# EAGLE design sender (EAGLE 7.7.0)
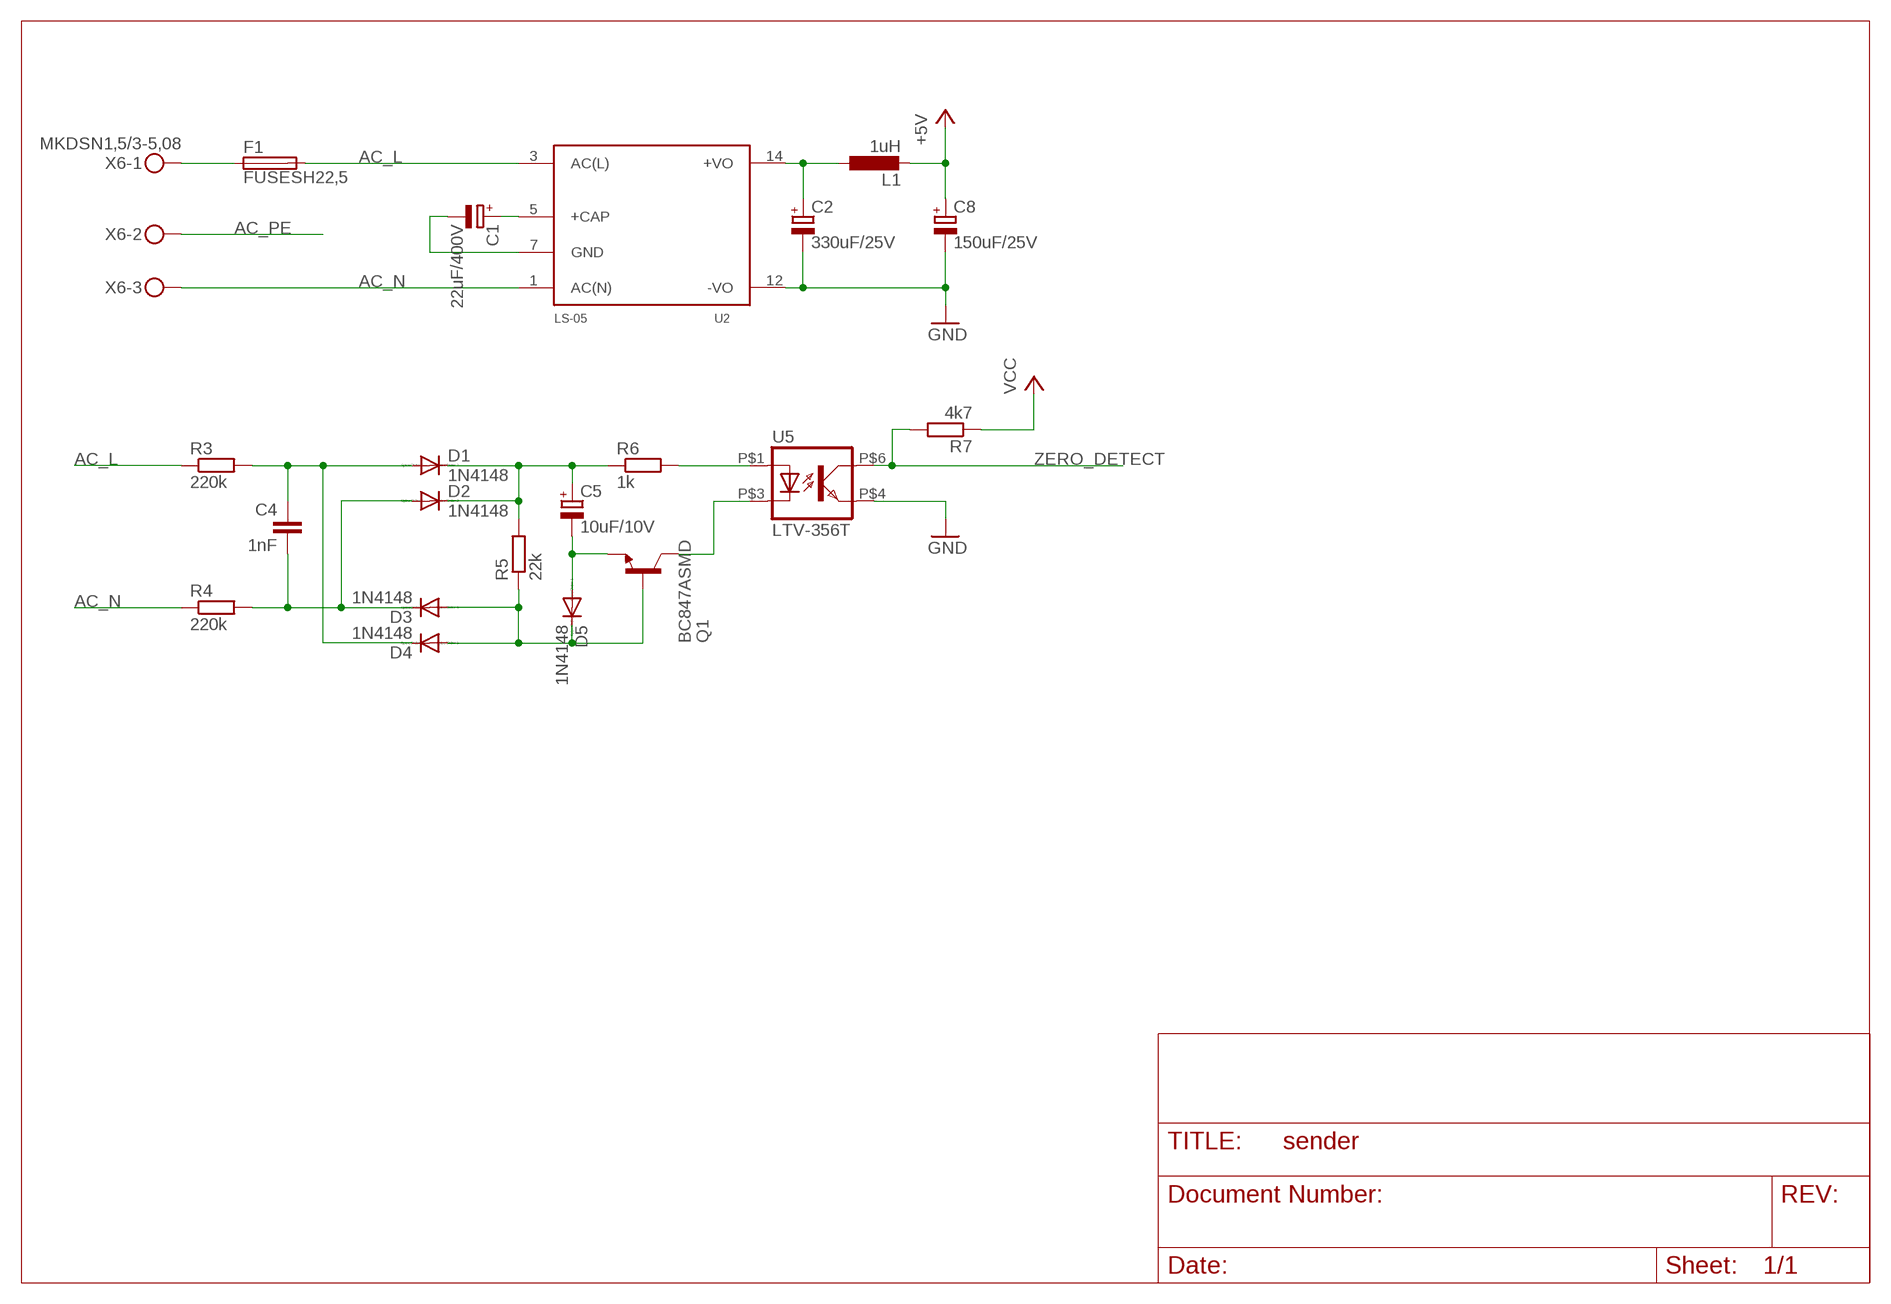
[diagram p0: schematic, sheet 1]

## Parts
C1  22uF/400V  CPOL-EUE7.5-16  [E7,5-16]
C2  330uF/25V  CPOL-EU150CLZ-1010  [150CLZ-1010]
C4  1nF  C-EU050-050X075  [C050-050X075]
C5  10uF/10V  CPOL-EU153CLV-0505  [153CLV-0505]
C8  150uF/25V  CPOL-EU153CLV-0810  [153CLV-0810]
D1  1N4148  DIODE-SOD323-W  [SOD323-W]
D2  1N4148  DIODE-SOD323-W  [SOD323-W]
D3  1N4148  DIODE-SOD323-W  [SOD323-W]
D4  1N4148  DIODE-SOD323-W  [SOD323-W]
D5  1N4148  DIODE-SOD323-W  [SOD323-W]
F1  FUSESH22,5  [SH22,5]
L1  1uH  L-EUL3225P  [L3225P]
Q1  BC847ASMD  [SOT23]
R3  220k  R-EU_R0603  [R0603]
R4  220k  R-EU_R0603  [R0603]
R5  22k  R-EU_R0603  [R0603]
R6  1k  R-EU_R0603  [R0603]
R7  4k7  R-EU_R0603  [R0603]
U2  LS-05  [LS-05]
U5  LTV-356T  [SMD]
X6  MKDSN1,5/3-5,08  [MKDSN1,5/3-5,08]

## Nets
+5V: C8.+ L1.2
AC_L: F1.2 R3.1 U2.3(AC(L))
AC_N: R4.1 U2.1(AC(N)) X6.3
AC_PE: X6.2
GND: C2.- C8.- U2.12(-VO) U5.P$4(EMIT)
N$1: F1.1 X6.1
N$2: C2.+ L1.1 U2.14(+VO)
N$3: C1.+ U2.5(+CAP)
N$4: C4.1 D1.A D4.C R3.2
N$5: C5.+ D1.C D2.C R5.2 R6.1
N$6: C1.- U2.7(GND)
N$7: C4.2 D2.A D3.C R4.2
N$8: D3.A D4.A D5.C Q1.1(B) R5.1
N$9: C5.- D5.A Q1.2(E)
N$10: R6.2 U5.P$1(A)
N$11: Q1.3(C) U5.P$3(C)
VCC: R7.1
ZERO_DETECT: R7.2 U5.P$6(COL)

## Library data of the parts
C1 C2 C5 C8 = rcl:CPOL-EU: POLARIZED CAPACITOR, European symbol
C4 = rcl:C-EU: CAPACITOR, European symbol
D1-D5 = diode:DIODE-: DIODE
F1 = fuse:FUSE: Fuse; OC_FARNELL: unknown; OC_NEWARK: unknown
L1 = rcl:L-EU: INDUCTOR, European symbol
Q1 = transistor-npn:BC847*: NPN Transistor
R3-R7 = rcl:R-EU_: RESISTOR, European symbol
U2 = rs-acdc:LS-05
U5 = optocoupler:LTV-356T
X6 = con-phoenix-508:MKDSN1,5/3-5,08: MKDSN 1,5/ 3-5,08 Printklemme Nennstrom: 13,5 A Nennspannung: 250 V Rastermaß: 5,08 mm Polzahl: 3 Anschlussart: Schraubanschluss Montage: Löten Anschlussrichtung Leiter/Platine: 0 ° Artikelnummer: 1729131 Source: http://eshop.phoenixcontact.com .. 1729131.pdf

## Board
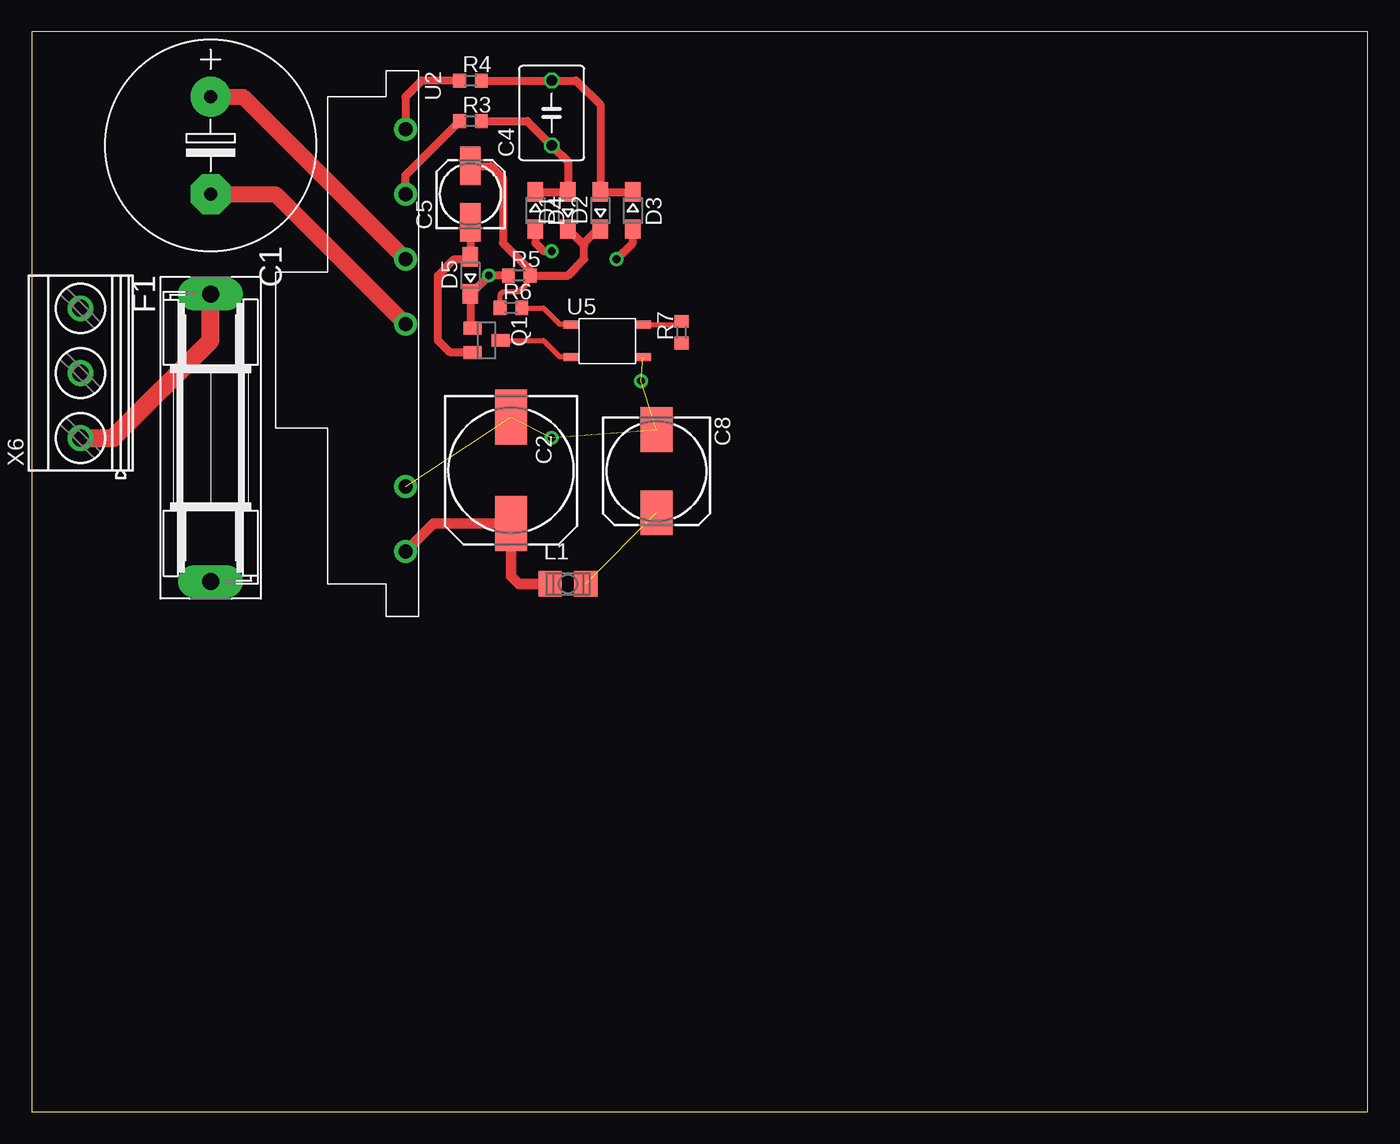
[diagram p1: board, top side]
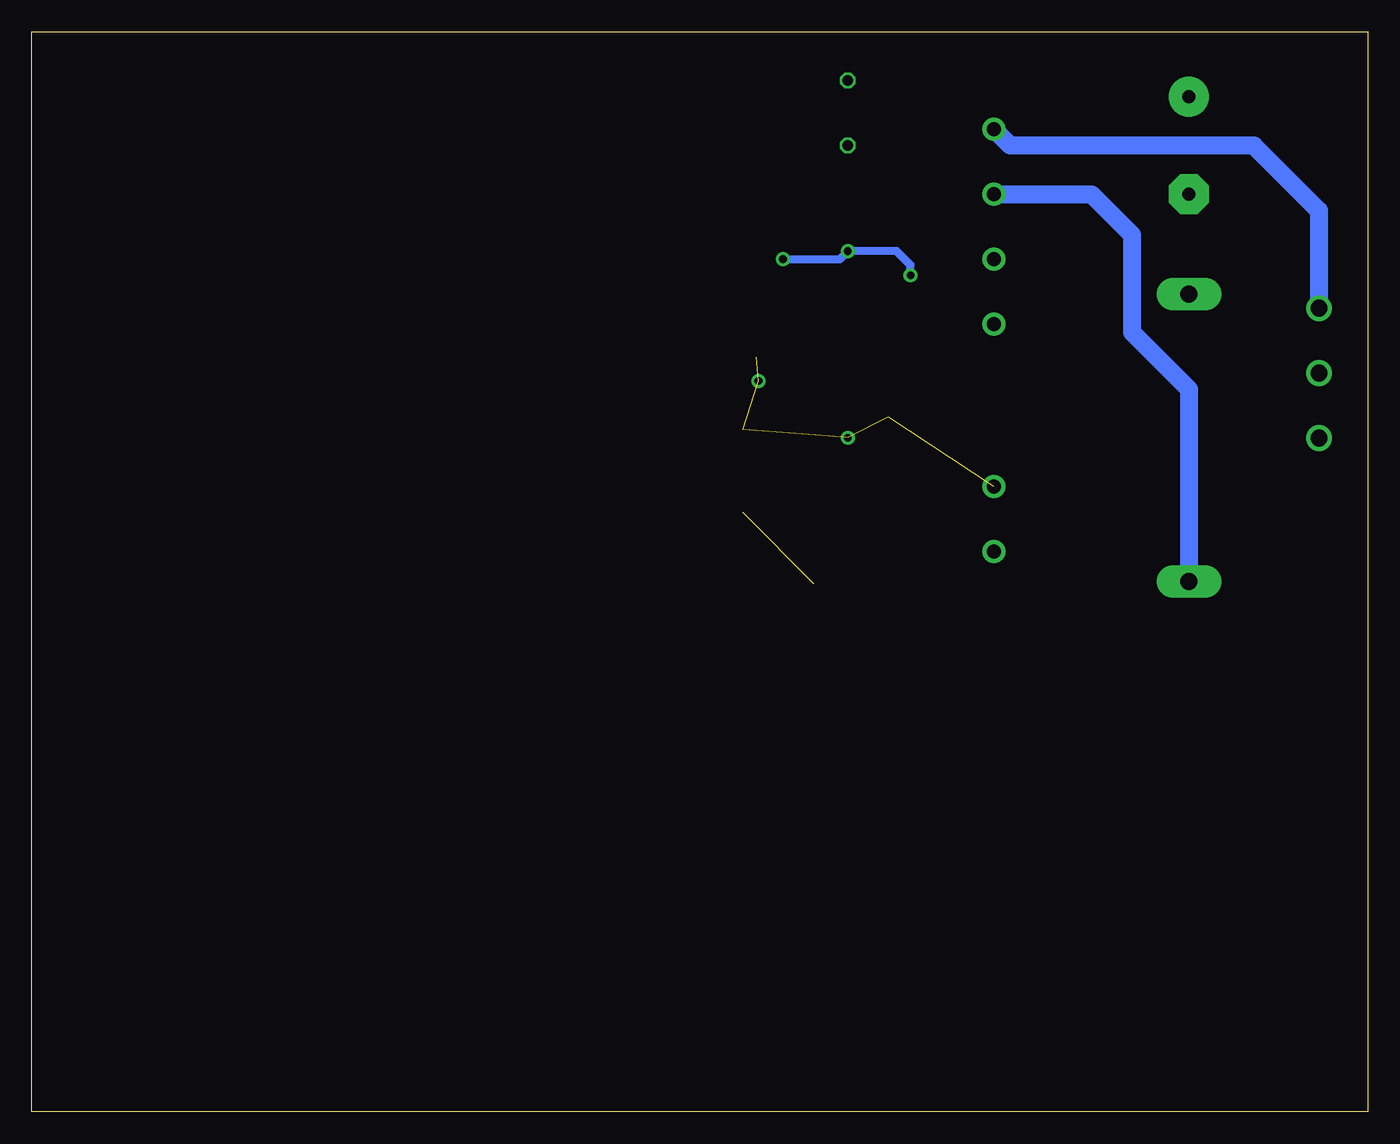
[diagram p2: board, bottom side, seen from below]

Size 104.44 x 84.44 mm. Coordinates in mm from the lower left corner, seen from the top.
Outline: 0,0 104.44,0 104.44,84.44 0,84.44 0,0
Copper layers (1*16): Top 0.035mm / dielectric 1.5mm / Bottom 0.035mm
Design rules "PCB-POOL Standard": minimum track width 0.15mm, minimum drill 0.3mm, track to track 0.15mm, track to pad 0.15mm, pad to pad 0.15mm, via to via 0.15mm, smd to smd 0.15mm, copper to edge 0.3mm, drill to drill 0.2mm, minimum pad ring 0.2mm, minimum via ring 0.15mm, stop-mask expansion 0.075mm, vias tented up to drill 0mil, thermal gap 0.2mm

### Footprints (pad centres in the part's own frame; a part is rotated, then mirrored left to right if it is on the bottom)
E7,5-16 = drill 1.016 pad 3.15: + -3.81,0 | drill 1.016 pad 3.15 octagon: - 3.81,0
150CLZ-1010 = smd 4.3 x 2.5: + 4.15,0; - -4.15,0
C050-050X075 = drill 0.813 octagon: 1 -2.54,0; 2 2.54,0
153CLV-0505 = smd 3 x 1.6: + 2.2,0; - -2.2,0
153CLV-0810 = smd 3.5 x 2.5: + 3.25,0; - -3.25,0
SOD323-W = smd 1.5 x 1.2: A 1.45,0; C -1.45,0
SH22,5 = drill 1.321 pad 2.54 long: 1 -11.252,0; 2 11.252,0
L3225P = smd 1.8 x 2: 1 -1.4,0; 2 1.4,0
SOT23 = smd 1 x 1.4: 1 -0.95,-1.1; 2 0.95,-1.1; 3 0,1.1
R0603 = smd 1 x 1.1: 1 -0.85,0; 2 0.85,0
LS-05 = drill 1.1 pad 1.778: 1 -17.78,0; 3 -12.7,0; 5 -7.62,0; 7 -2.54,0; 12 10.16,0; 14 15.24,0
SMD = smd 1.27 x 0.635: P$1 -2.88,1.24; P$3 -2.88,-1.3; P$4 2.7,-1.3; P$6 2.7,1.24
MKDSN1,5/3-5,08 = drill 1.3 pad 2: 1 -7.641,0.025; 2 -2.561,0.025; 3 2.519,0.025

### Placement (x,y rotation side)
C1  13.97,75.56 270 top
C2  37.47,50.17 270 top
C4  40.64,78.1 90 top
C5  34.29,71.75 90 top
C8  48.84,50.1 270 top
D1  41.91,70.48 90 top
D2  44.45,70.48 90 top
D3  46.99,70.48 270 top
D4  39.37,70.48 270 top
D5  34.29,65.41 90 top
F1  13.97,52.71 270 top
L1  41.91,41.28 0 top
Q1  35.56,60.33 270 top
R3  34.29,77.47 0 top
R4  34.29,80.64 0 top
R5  38.1,65.41 0 top
R6  37.47,62.87 0 top
R7  50.8,60.96 90 top
U2  29.21,59.05 270 top
U5  45.09,60.33 0 top
X6  3.81,60.33 90 top

### Tracks (layer width: path | path; a pad name or v marks a point on that pad's centre or on a via)
+5V  (1 unrouted)
AC_L
  Top 0.61: U2.3 29.21,73.24 R3.1
  Bottom 1.422: U2.3 21.59,71.75 18.41,68.58 18.41,60.96 13.97,56.52 F1.2
AC_N
  Top 0.61: R4.1 30.48,80.64 29.21,79.38 U2.1
  Bottom 1.27: 3.81,62.87 X6.3
  Bottom 1.422: U2.1 27.94,75.56 8.89,75.56 3.81,70.48 3.81,62.87
GND  (via drill 0.6)  (5 unrouted)
  other vias: 40.64,52.71 47.62,57.15
N$1
  Top 1.422: X6.1 6.33,52.68 13.97,60.33 F1.1
N$2
  Top 0.813: U2.14 31.41,46.02 C2.+ 37.47,41.91 38.1,41.28 L1.1
N$3
  Top 1.27: C1.+ 16.51,79.38 U2.5
N$4
  Top 0.61: D4.C D1.A 41.91,74.3 C4.1 38.73,77.47 R3.2
N$5
  Top 0.406: R6.1 36.62,63.92 36.83,64.14 38.1,64.14 38.73,64.77 38.73,65.19 R5.2
  Top 0.61: 41.91,69.21 D1.C 43.09,67.85 | 43.09,67.85 43.18,67.77 43.18,66.67 41.91,65.41 R5.2 38.95,65.83 36.83,67.94 36.83,73.02 35.9,73.95 C5.+ | D2.C 44.27,69.03 43.09,67.85
N$6
  Top 1.27: C1.- 19.05,71.75 U2.7
N$7
  Top 0.61: D3.C D2.A 44.45,78.74 42.55,80.64 C4.2 R4.2
N$8  (via drill 0.6)
  Top 0.61: R5.1 v35.74,65.41 D5.C 34.29,61.45 Q1.1 | v45.72,66.67 46.99,67.94 D3.A | D4.A 39.37,67.94 40.01,67.31 v40.64,67.31
  Bottom 0.61: v45.72,66.67 41.27,66.67 v40.64,67.31 36.83,67.31 35.74,66.22 v35.74,65.41
N$9
  Top 0.61: C5.- D5.A 34.11,66.67 33.02,66.67 31.75,65.41 31.75,60.33 32.7,59.38 Q1.2
N$10
  Top 0.406: R6.2 40.01,62.87 41.27,61.6 42.17,61.6 U5.P$1
N$11
  Top 0.406: Q1.3 40.01,60.33 41.27,59.05 42.17,59.05 U5.P$3
ZERO_DETECT
  Top 0.406: U5.P$6 50.8,61.57 R7.2